# EAGLE design v2 (EAGLE 6.4)
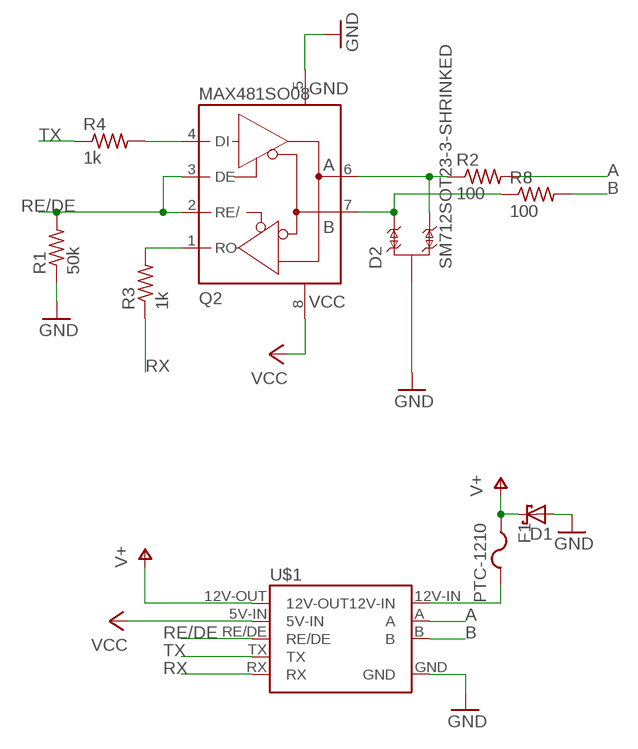
[diagram p0: schematic, sheet 1]

## Parts
D1  SCHOTTKY-DIODESMC  [SMC]
D2  SM712SOT23-3-SHRINKED  [SOT23-3-SHRINKED]
F1  PTC-1210  [1210]
Q2  MAX481SO08  [SO08]
R1  50k  R-US_R0603  [R0603]
R2  100  R-US_R0603  [R0603]
R3  1k  R-US_R0603  [R0603]
R4  1k  R-US_R0603  [R0603]
R8  100  R-US_R0603  [R0603]
U$1  RS485-ADAPTER  [RS485-ADAPTOR]

## Nets
12V-IN: F1.2 U$1.12V-IN
A: R2.2 U$1.A
B: R8.2 U$1.B
GND: D1.A D2.3 Q2.5(GND) R1.1 U$1.GND
N$4: D2.2 Q2.7(B) R8.1
N$5: Q2.1(RO) R3.2
N$6: Q2.4(DI) R4.2
N$9: D2.1 Q2.6(A) R2.1
RE/DE: Q2.2(RE/) Q2.3(DE) R1.2 U$1.RE/DE
RX: R3.1 U$1.RX
TX: R4.1 U$1.TX
V+: D1.C F1.1 U$1.12V-OUT
VCC: Q2.8(+5V) U$1.5V-IN

## Library data of the parts
D1 = diode:SCHOTTKY-DIODE: Schottky Diode
D2 = serge:SM712: SM712 Series 600W Asymmetrical TVS Diode Array; Datasheet: http://www.littelfuse.com/~/media/electronics/datasheets/tvs_diode_arrays/littelfuse_tvs_diode_array_sm712_datasheet.pdf.pdf
F1 = serge:PTC-1210
Q2 = serge:MAX481
R1-R4 R8 = adafruit:R-US_: RESISTOR, American symbol
U$1 = serge:RS485-ADAPTER

## Board
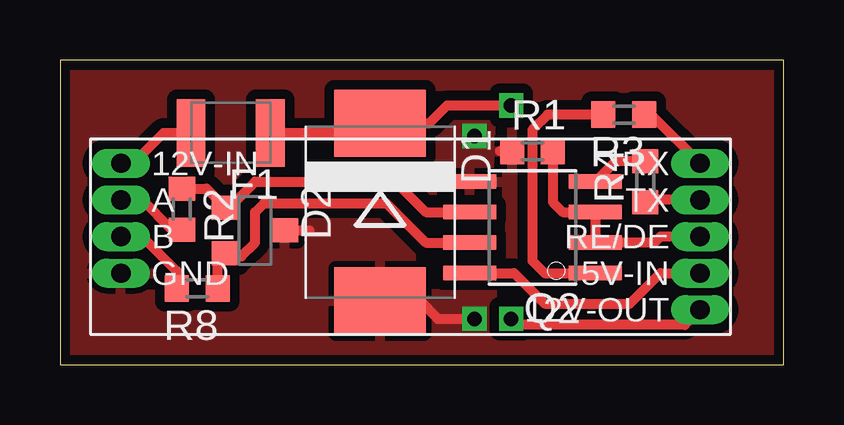
[diagram p1: board, top side]
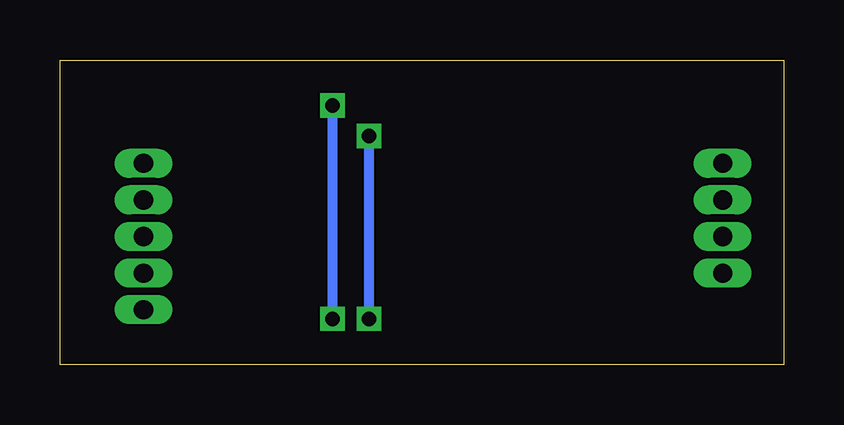
[diagram p2: board, bottom side, seen from below]

Size 30.15 x 12.69 mm. Coordinates in mm from the lower left corner, seen from the top.
Outline: 0,0 30.15,0 30.15,12.69 0,12.69 0,0
Copper layers (1*16): Top 0.035mm / dielectric 1.5mm / Bottom 0.035mm
Design rules "default *": minimum track width 10mil, minimum drill 24mil, track to track 16mil, track to pad 16mil, pad to pad 16mil, via to via 16mil, smd to smd 16mil, copper to edge 16mil, drill to drill 8mil, minimum pad ring 7mil, minimum via ring 8mil, stop-mask expansion 4mil, vias tented up to drill 0mil, thermal gap 10mil

### Footprints (pad centres in the part's own frame; a part is rotated, then mirrored left to right if it is on the bottom)
SMC = smd 2.8 x 3.8: A 3.7,0; C -3.7,0
SOT23-3-SHRINKED = smd 1 x 1.146: 1 -0.95,-1.227; 2 0.95,-1.227; 3 0,1.227
1210 = smd 1.2 x 2.8: 1 -1.65,0; 2 1.65,0
SO08 = smd 0.61 x 2.21: 1 -1.905,-2.616; 2 -0.635,-2.616; 3 0.635,-2.616; 4 1.905,-2.616; 5 1.905,2.616; 6 0.635,2.616; 7 -0.635,2.616; 8 -1.905,2.616
R0603 = smd 1 x 1.1: 1 -0.85,0; 2 0.85,0
RS485-ADAPTOR = drill 0.8 pad 1.016 long: 5V-IN -12.7,0.762; 12V-IN 11.43,-3.81; 12V-OUT -12.7,2.286; A 11.43,-2.286; B 11.43,-0.762; GND 11.43,0.762; RE/DE -12.7,-0.762; RX -12.7,-3.81; TX -12.7,-2.286

### Placement (x,y rotation side)
D1  13.34,6.35 270 top
D2  8.13,5.59 270 top
F1  7.11,9.65 180 top
Q2  19.68,5.71 90 top
R1  19.68,8.89 0 top
R2  5.08,6.48 270 top
R3  23.5,10.41 180 top
R4  24.38,7.62 90 top
R8  5.71,3.17 180 top
U$1  13.97,4.57 180 top

### Tracks (layer width: path | path; a pad name or v marks a point on that pad's centre or on a via)
12V-IN
  Top 0.406: U$1.12V-IN 3.05,8.38 4.32,9.65 F1.2
A
  Top 0.406: R2.2 4.66,5.63 3.43,6.86 U$1.A
B
  Top 0.406: R8.2 4.87,3.9 3.43,5.33 U$1.B
GND  (via drill 0.6)
  Top 0.406: D2.3 10.4,5.59 | 18.72,8.64 R1.1 18.34,8.89 | D1.A 15,2.65 15.75,1.91 v17.27,1.91
  Bottom 0.406: v17.27,1.91 v17.27,9.53
  pour Top: 0,12.7 30.48,12.7 30.48,0 0,0
N$4
  Top 0.406: R8.1 6.57,4.05 D2.2 7.56,4.51 8.13,5.08 8.13,6.35 8.51,6.73 13.59,6.73 15.24,5.08 Q2.7
N$5
  Top 0.406: R3.2 20.32,10.41 19.68,9.78 19.68,4.32 20.19,3.81 Q2.1
N$6
  Top 0.406: R4.2 23.15,8.47 Q2.4
N$9
  Top 0.406: Q2.6 15.24,6.35 13.97,7.62 8.13,7.62 7.3,6.79 D2.1 6.11,7.33 R2.1
RE/DE
  Top 0.406: R1.2 20.54,6.77 20.95,6.35 Q2.3 Q2.2 24.77,5.08 25.02,5.33 U$1.RE/DE
RX
  Top 0.406: R3.1 24.64,10.41 U$1.RX
TX
  Top 0.406: U$1.TX 24.34,6.86 R4.1
V+  (via drill 0.6)
  Top 0.406: F1.1 12.94,9.65 D1.C 15.38,10.05 16.13,10.79 v18.8,10.79 | U$1.12V-OUT 26.04,1.65 19.05,1.65 v18.8,1.91
  Bottom 0.406: v18.8,10.79 v18.8,1.91
VCC
  Top 0.406: Q2.8 18.92,3.81 20.19,2.54 23.75,2.54 25.02,3.81 U$1.5V-IN